# EAGLE design New_SERV_OPEN8_SOTB (EAGLE 9.6.2)
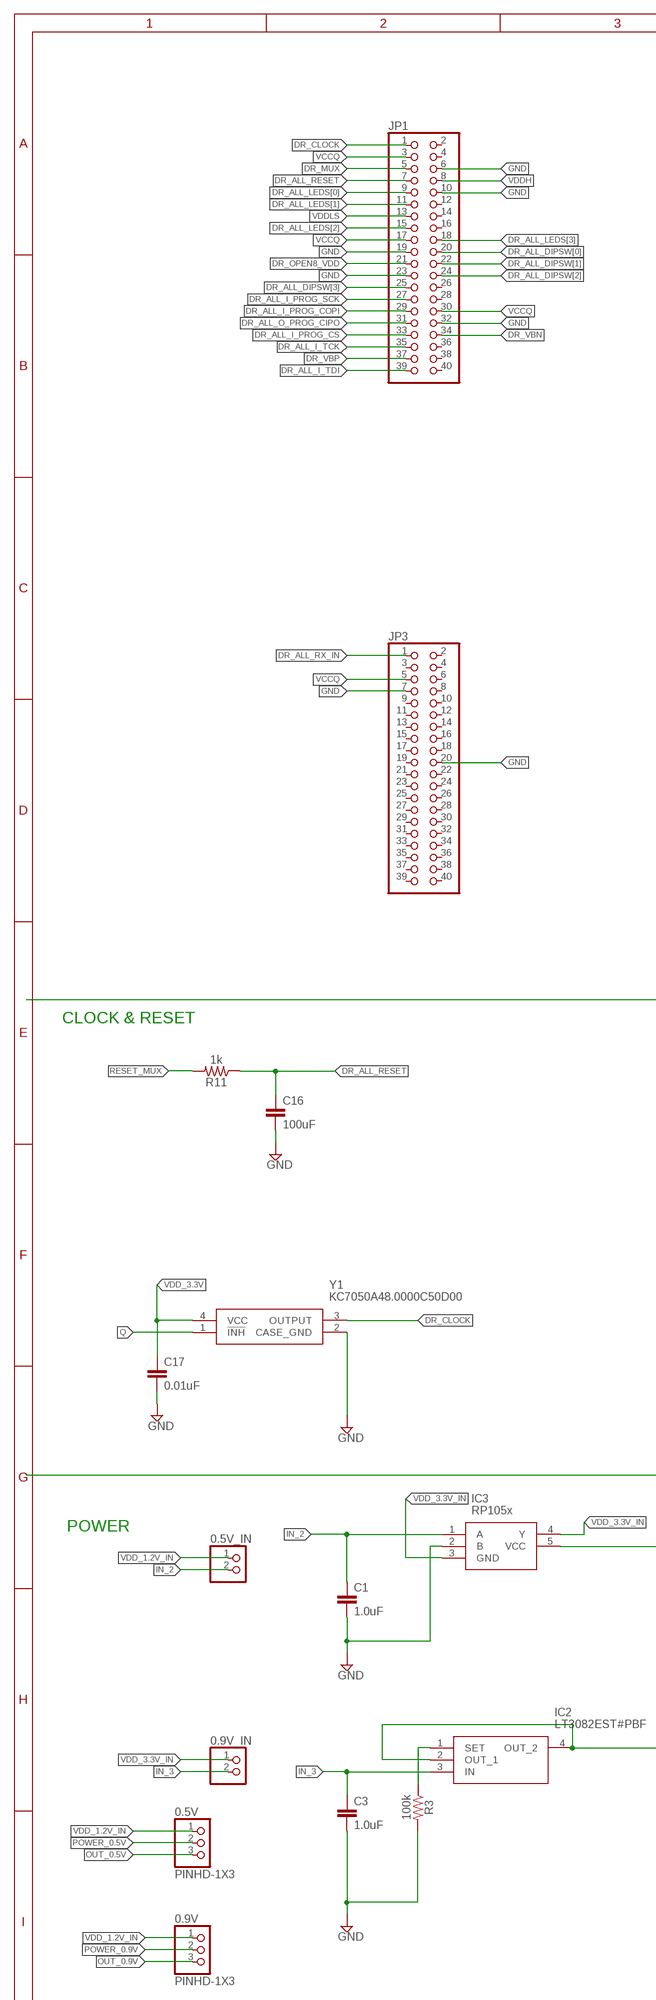
[diagram p0: schematic, sheet 1, part 1 of 2]
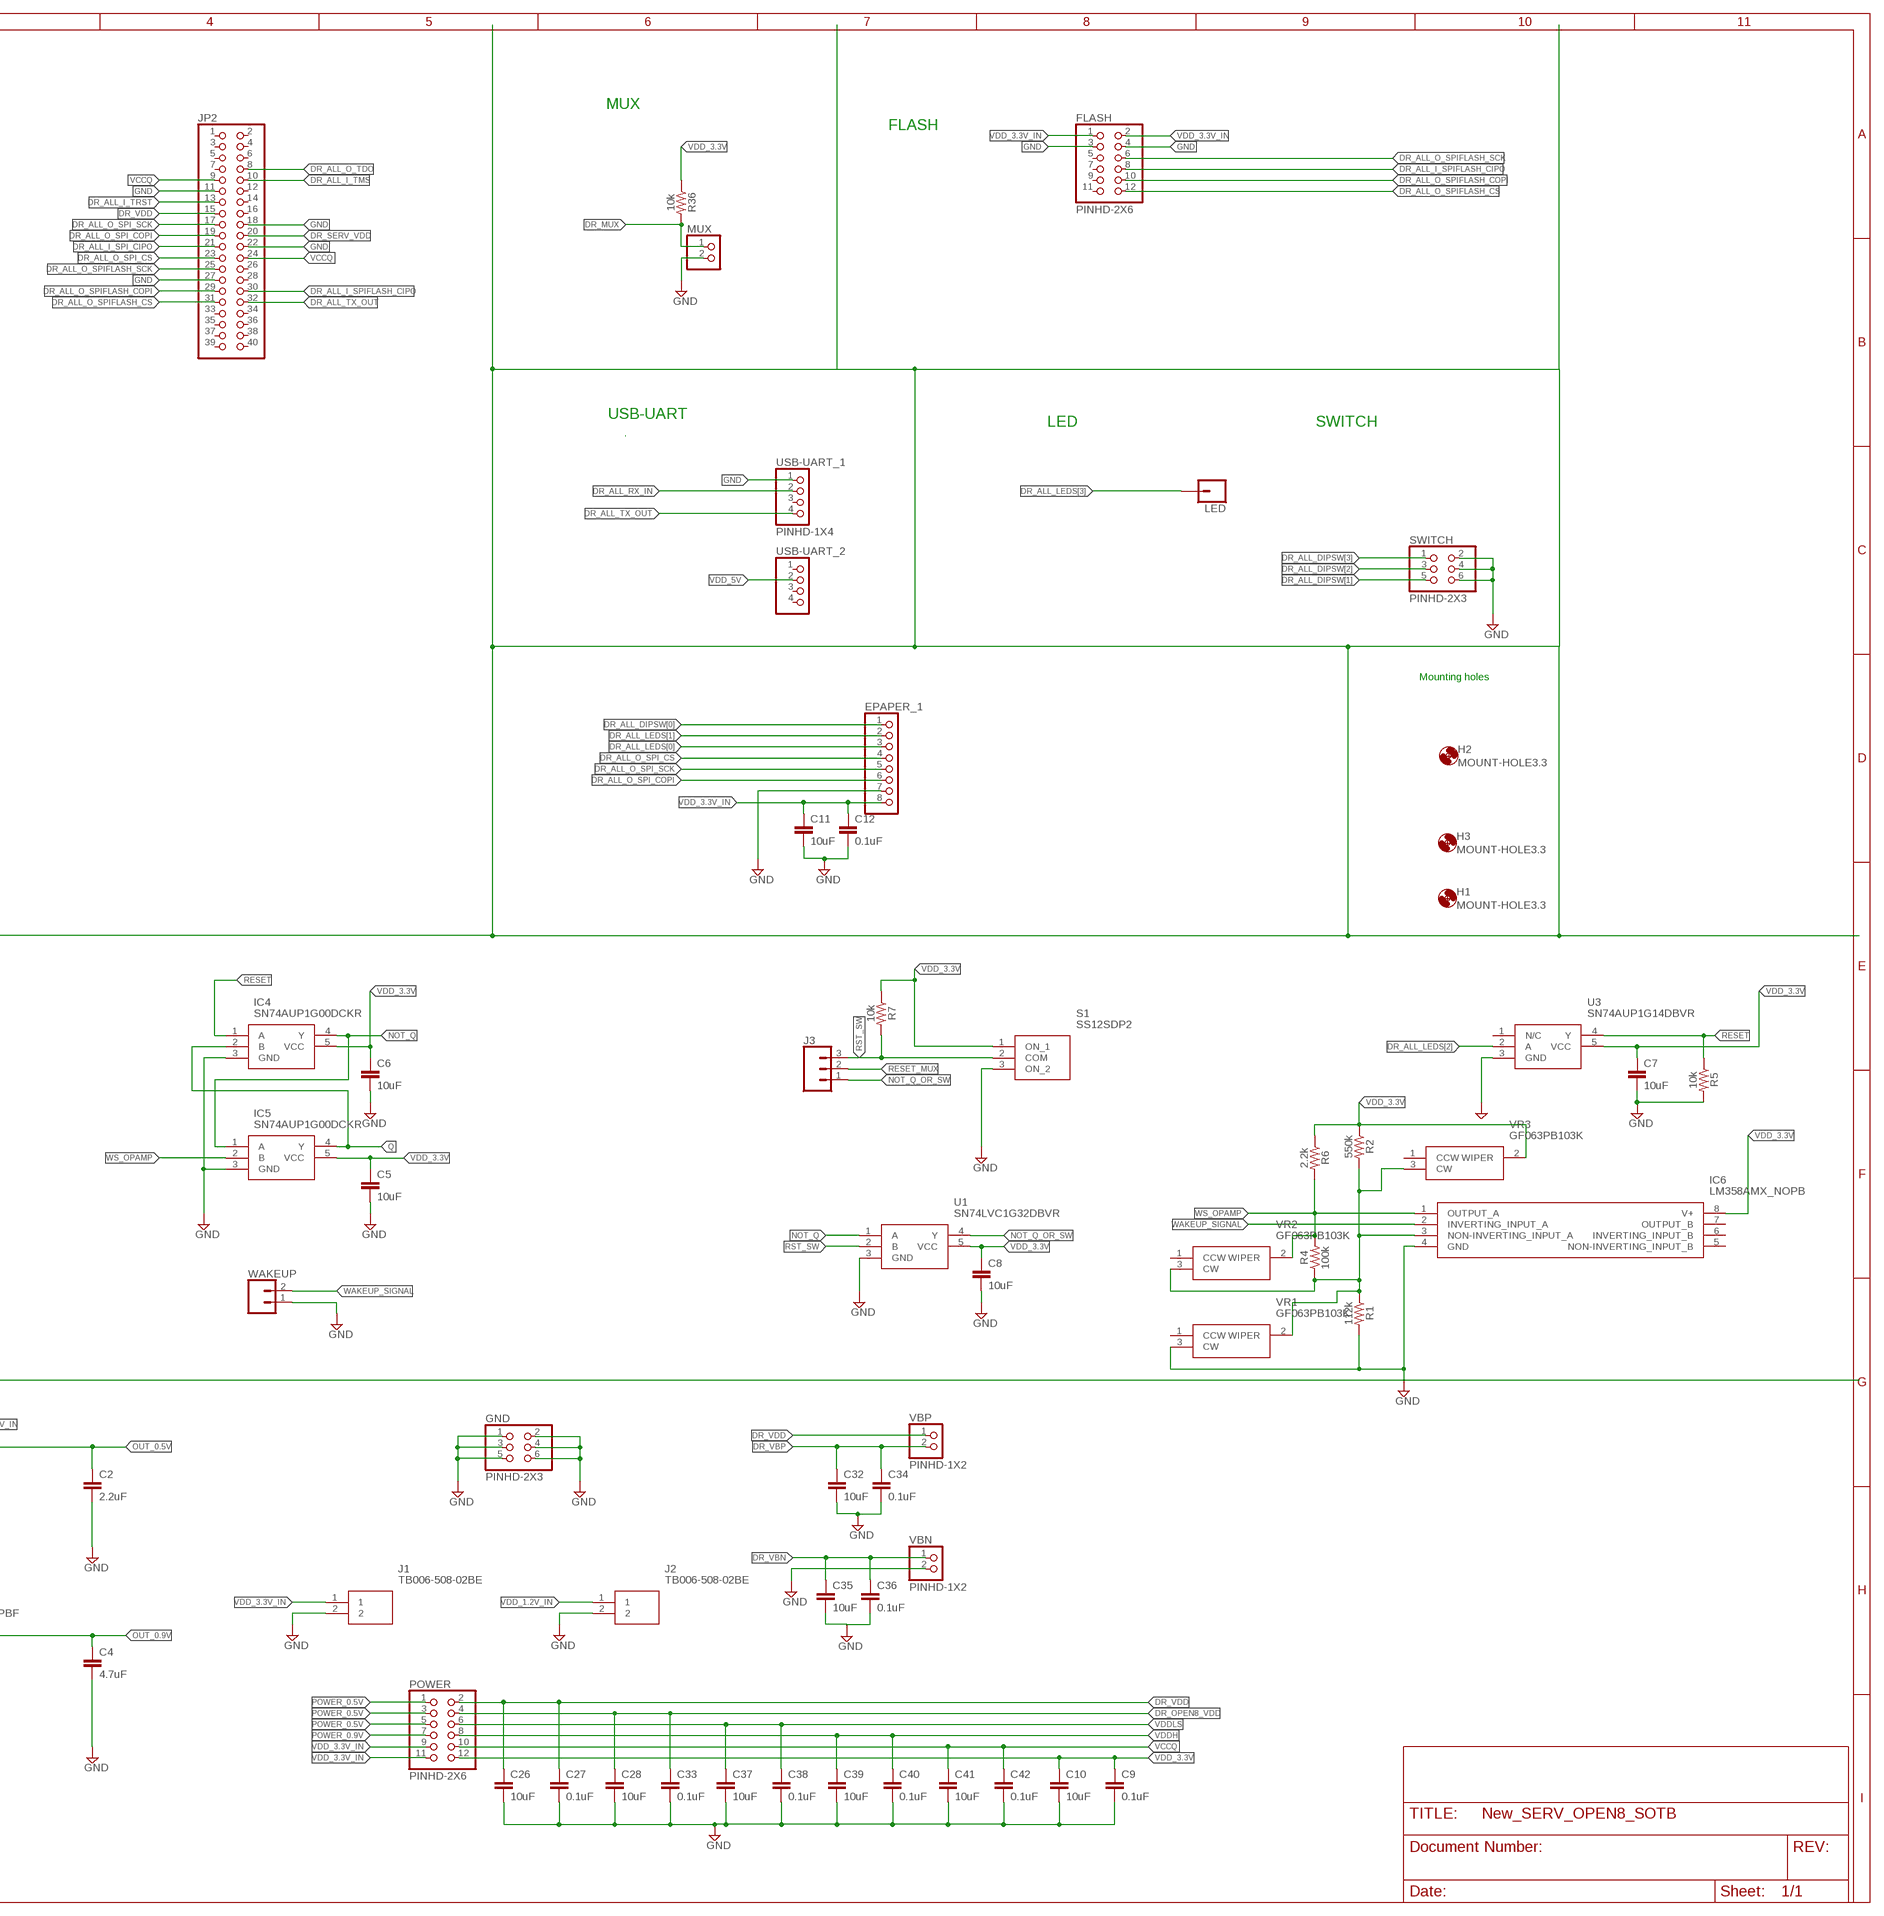
[diagram p1: schematic, sheet 1, part 2 of 2]

## Parts
0.5V  PINHD-1X3  [1X03]
0.5V_IN  PINHD-1X2  [1X02]
0.9V  PINHD-1X3  [1X03]
0.9V_IN  PINHD-1X2  [1X02]
C1  1.0uF  1.0UF-0805-25V-(+80/-20%)  [0805]
C2  2.2uF  1.0UF-0805-25V-(+80/-20%)  [0805]
C3  1.0uF  1.0UF-0805-25V-(+80/-20%)  [0805]
C4  4.7uF  1.0UF-0805-25V-(+80/-20%)  [0805]
C5  10uF  1.0UF-0805-25V-(+80/-20%)  [0805]
C6  10uF  1.0UF-0805-25V-(+80/-20%)  [0805]
C7  10uF  1.0UF-0805-25V-(+80/-20%)  [0805]
C8  10uF  1.0UF-0805-25V-(+80/-20%)  [0805]
C9  0.1uF  1.0UF-0805-25V-(+80/-20%)  [0805]
C10  10uF  1.0UF-0805-25V-(+80/-20%)  [0805]
C11  10uF  1.0UF-0805-25V-(+80/-20%)  [0805]
C12  0.1uF  1.0UF-0805-25V-(+80/-20%)  [0805]
C16  100uF  1.0UF-0805-25V-(+80/-20%)  [0805]
C17  0.01uF  1.0UF-0805-25V-(+80/-20%)  [0805]
C26  10uF  1.0UF-0805-25V-(+80/-20%)  [0805]
C27  0.1uF  1.0UF-0805-25V-(+80/-20%)  [0805]
C28  10uF  1.0UF-0805-25V-(+80/-20%)  [0805]
C32  10uF  1.0UF-0805-25V-(+80/-20%)  [0805]
C33  0.1uF  1.0UF-0805-25V-(+80/-20%)  [0805]
C34  0.1uF  1.0UF-0805-25V-(+80/-20%)  [0805]
C35  10uF  1.0UF-0805-25V-(+80/-20%)  [0805]
C36  0.1uF  1.0UF-0805-25V-(+80/-20%)  [0805]
C37  10uF  1.0UF-0805-25V-(+80/-20%)  [0805]
C38  0.1uF  1.0UF-0805-25V-(+80/-20%)  [0805]
C39  10uF  1.0UF-0805-25V-(+80/-20%)  [0805]
C40  0.1uF  1.0UF-0805-25V-(+80/-20%)  [0805]
C41  10uF  1.0UF-0805-25V-(+80/-20%)  [0805]
C42  0.1uF  1.0UF-0805-25V-(+80/-20%)  [0805]
EPAPER_1  PINHD-1X8  [1X08]
FLASH  PINHD-2X6  [2X06]
GND  PINHD-2X3  [2X03]
H1  MOUNT-HOLE3.3  [3,3]
H2  MOUNT-HOLE3.3  [3,3]
H3  MOUNT-HOLE3.3  [3,3]
IC2  LT3082EST#PBF  [SOT230P700X180-4N]
IC3  RP105x  SN74LVC1G32DBVR  [SOT95P280X145-5N]
IC4  SN74AUP1G00DCKR  [SOT65P210X110-5N]
IC5  SN74AUP1G00DCKR  [SOT65P210X110-5N]
IC6  LM358AMX_NOPB  [SOIC127P600X175-8N]
J1  TB006-508-02BE  [TB00650802BE]
J2  TB006-508-02BE  [TB00650802BE]
J3  CONN_03  [1X03]
JP1  PINHD-2X20  [2X20]
JP2  PINHD-2X20  [2X20]
JP3  PINHD-2X20  [2X20]
LED  CONN_01  [1X01]
MUX  PINHD-1X2  [1X02]
POWER  PINHD-2X6  [2X06]
R1  112k  0.3OHM-0805-1/8W-1%  [0805]
R2  550k  0.3OHM-0805-1/8W-1%  [0805]
R3  100k  0.3OHM-0805-1/8W-1%  [0805]
R4  100k  0.3OHM-0805-1/8W-1%  [0805]
R5  10k  0.3OHM-0805-1/8W-1%  [0805]
R6  2.2k  0.3OHM-0805-1/8W-1%  [0805]
R7  10k  0.3OHM-0805-1/8W-1%  [0805]
R11  1k  0.3OHM-0805-1/8W-1%  [0805]
R36  10k  0.3OHM-0805-1/8W-1%  [0805]
S1  SS12SDP2  [SS12SDP2]
SWITCH  PINHD-2X3  [2X03]
U1  SN74LVC1G32DBVR  [SOT95P280X145-5N]
U3  SN74AUP1G14DBVR  [SOT65P210X110-5N]
USB-UART_1  PINHD-1X4  [1X04]
USB-UART_2  PINHD-1X4  [1X04]
VBN  PINHD-1X2  [1X02]
VBP  PINHD-1X2  [1X02]
VR1  GF063PB103K  [GF063PB103K]
VR2  GF063PB103K  [GF063PB103K]
VR3  GF063PB103K  [GF063PB103K]
WAKEUP  CONN_02  [1X02]
Y1  KC7050A48.0000C50D00  [KC7050A480000C50D00]

## Nets
DR_ALL_DIPSW[0]: EPAPER_1.1 JP1.20
DR_ALL_DIPSW[1]: JP1.22 SWITCH.5
DR_ALL_DIPSW[2]: JP1.24 SWITCH.3
DR_ALL_DIPSW[3]: JP1.25 SWITCH.1
DR_ALL_I_PROG_COPI: JP1.29
DR_ALL_I_PROG_CS: JP1.33
DR_ALL_I_PROG_SCK: JP1.27
DR_ALL_I_SPI_CIPO: JP2.21
DR_ALL_I_SPIFLASH_CIPO: FLASH.8 JP2.30
DR_ALL_I_TCK: JP1.35
DR_ALL_I_TDI: JP1.39
DR_ALL_I_TMS: JP2.10
DR_ALL_I_TRST: JP2.13
DR_ALL_LEDS[0]: EPAPER_1.3 JP1.9
DR_ALL_LEDS[1]: EPAPER_1.2 JP1.11
DR_ALL_LEDS[2]: JP1.15 U3.2(A)
DR_ALL_LEDS[3]: JP1.18 LED.1
DR_ALL_O_PROG_CIPO: JP1.31
DR_ALL_O_SPI_COPI: EPAPER_1.6 JP2.19
DR_ALL_O_SPI_CS: EPAPER_1.4 JP2.23
DR_ALL_O_SPI_SCK: EPAPER_1.5 JP2.17
DR_ALL_O_SPIFLASH_COPI: FLASH.10 JP2.29
DR_ALL_O_SPIFLASH_CS: FLASH.12 JP2.31
DR_ALL_O_SPIFLASH_SCK: FLASH.6 JP2.25
DR_ALL_O_TDO: JP2.8
DR_ALL_RESET: C16.1 JP1.7 R11.1
DR_ALL_RX_IN: JP3.1 USB-UART_1.2
DR_ALL_TX_OUT: JP2.32 USB-UART_1.4
DR_CLOCK: JP1.1 Y1.3(OUTPUT)
DR_MUX: JP1.5 MUX.1 R36.2
DR_OPEN8_VDD: C28.1 C33.1 JP1.21 POWER.4
DR_SERV_VDD: JP2.20
DR_VBN: C35.1 C36.1 JP1.34 VBN.1
DR_VBP: C32.1 C34.1 JP1.37 VBP.2
DR_VDD: C26.1 C27.1 JP2.15 POWER.2 VBP.1
GND: C1.2 C2.2 C3.2 C4.2 C5.2 C6.2 C7.2 C8.2 C9.2 C10.2 C11.2 C12.2 C16.2 C17.2 C26.2 C27.2 C28.2 C32.2 C33.2 C34.2 C35.2 C36.2 C37.2 C38.2 C39.2 C40.2 C41.2 C42.2 EPAPER_1.7 FLASH.3 FLASH.4 GND.1 GND.2 GND.3 GND.4 GND.5 GND.6 IC3.2(B) IC4.3(GND) IC5.3(GND) IC6.4(GND) J1.2 J2.2 JP1.6 JP1.10 JP1.19 JP1.23 JP1.32 JP2.11 JP2.18 JP2.22 JP2.27 JP3.7 JP3.20 MUX.2 R1.2 R3.2 R5.2 S1.3(ON_2) SWITCH.2 SWITCH.4 SWITCH.6 U1.3(GND) U3.3(GND) USB-UART_1.1 VBN.2 VR1.3(CW) WAKEUP.1 Y1.2(CASE_GND)
IN_2: 0.5V_IN.2 C1.1 IC3.1(A)
IN_3: 0.9V_IN.2 C3.1 IC2.3(IN)
N$1: IC2.1(SET) R3.1
N$4: IC6.3(NON-INVERTING_INPUT_A) R1.1 R2.2 R4.1 VR1.2(WIPER) VR2.3(CW) VR3.3(CW)
NOT_Q: IC4.4(Y) IC5.1(A) U1.1(A)
NOT_Q_OR_SW: J3.1 U1.4(Y)
OUT_0.5V: 0.5V.3 C2.1 IC3.5(VCC)
OUT_0.9V: 0.9V.3 C4.1 IC2.2(OUT_1) IC2.4(OUT_2)
POWER_0.5V: 0.5V.2 POWER.1 POWER.3 POWER.5
POWER_0.9V: 0.9V.2 POWER.7
Q: IC4.2(B) IC5.4(Y) Y1.1(!INH)
RESET: IC4.1(A) R5.1 U3.4(Y)
RESET_MUX: J3.2 R11.2
RST_SW: J3.3 R7.2 S1.2(COM) U1.2(B)
VCCQ: C41.1 C42.1 JP1.3 JP1.17 JP1.30 JP2.9 JP2.24 JP3.5 POWER.10
VDD_1.2V_IN: 0.5V.1 0.5V_IN.1 0.9V.1 J2.1
VDD_3.3V: C5.1 C6.1 C7.1 C8.1 C9.1 C10.1 C17.1 IC4.5(VCC) IC5.5(VCC) IC6.8(V+) POWER.12 R2.1 R6.1 R7.1 R36.1 S1.1(ON_1) U1.5(VCC) U3.5(VCC) VR3.2(WIPER) Y1.4(VCC)
VDD_3.3V_IN: 0.9V_IN.1 C11.1 C12.1 EPAPER_1.8 FLASH.1 FLASH.2 IC3.3(GND) IC3.4(Y) J1.1 POWER.9 POWER.11
VDD_5V: USB-UART_2.2
VDDH: C39.1 C40.1 JP1.8 POWER.8
VDDLS: C37.1 C38.1 JP1.13 POWER.6
WAKEUP_SIGNAL: IC6.2(INVERTING_INPUT_A) WAKEUP.2
WS_OPAMP: IC5.2(B) IC6.1(OUTPUT_A) R4.2 R6.2 VR2.2(WIPER)
Unconnected: FLASH.5 FLASH.7 FLASH.9 FLASH.11 IC6.5(NON-INVERTING_INPUT_B) IC6.6(INVERTING_INPUT_B) IC6.7(OUTPUT_B) JP1.2 JP1.4 JP1.12 JP1.14 JP1.16 JP1.26 JP1.28 JP1.36 JP1.38 JP1.40 JP2.1 JP2.2 JP2.3 JP2.4 JP2.5 JP2.6 JP2.7 JP2.12 JP2.14 JP2.16 JP2.26 JP2.28 JP2.33 JP2.34 JP2.35 JP2.36 JP2.37 JP2.38 JP2.39 JP2.40 JP3.2 JP3.3 JP3.4 JP3.6 JP3.8 JP3.9 JP3.10 JP3.11 JP3.12 JP3.13 JP3.14 JP3.15 JP3.16 JP3.17 JP3.18 JP3.19 JP3.21 JP3.22 JP3.23 JP3.24 JP3.25 JP3.26 JP3.27 JP3.28 JP3.29 JP3.30 JP3.31 JP3.32 JP3.33 JP3.34 JP3.35 JP3.36 JP3.37 JP3.38 JP3.39 JP3.40 U3.1(N/C) USB-UART_1.3 USB-UART_2.1 USB-UART_2.3 USB-UART_2.4 VR1.1(CCW) VR2.1(CCW) VR3.1(CCW)

## Notes on the sheet
- MUX
- FLASH
- USB-UART
- LED | SWITCH
- Mounting holes
- CLOCK & RESET
- POWER

## Library data of the parts
0.5V 0.9V = Connector:PINHD-1X3: PIN HEADER; CATEGORY: CONNECTOR; SUB-CATEGORY: PIN-HEADER
0.5V_IN 0.9V_IN MUX = pinhead:PINHD-1X2: PIN HEADER
C1 C3 = SparkFun-Capacitors:1.0UF: 1µF ceramic capacitors A capacitor is a passive two-terminal electrical component used to store electrical energy temporarily in an electric field.; PROD_ID: CAP-11625
C2 C4-C12 C16 C17 C26-C28 C32-C42 = SparkFun-Capacitors:1.0UF: 1µF ceramic capacitors A capacitor is a passive two-terminal electrical component used to store electrical energy temporarily in an electric field.; PROD_ID: CAP-11625; VALUE: 1.0uF
EPAPER_1 = pinhead:PINHD-1X8: PIN HEADER
FLASH POWER = Connector:PINHD-2X6: PIN HEADER; CATEGORY: CONNECTOR; SUB-CATEGORY: PIN-HEADER
GND SWITCH = Connector:PINHD-2X3: PIN HEADER; CATEGORY: CONNECTOR; SUB-CATEGORY: PIN-HEADER
H1-H3 = holes:MOUNT-HOLE: MOUNTING HOLE with drill center marker
IC2 = SamacSys_Parts:LT3082EST#PBF: LINEAR TECHNOLOGY - LT3082EST#PBF - LDO, ADJ, 1.3VDO, 0.2A, 3SOT223 Source: Datasheet <http://www.analog.com/media/en/technical-documentation/data-sheets/3082f.pdf>; ARROW_PART_NUMBER: LT3082EST#PBF; ARROW_PRICE-STOCK: https://www.arrow.com/en/products/lt3082estpbf/analog-devices?region=nac; DESCRIPTION: LINEAR TECHNOLOGY - LT3082EST#PBF - LDO, ADJ, 1.3VDO, 0.2A, 3SOT223; HEIGHT: 1.8mm; MANUFACTURER_NAME: Analog Devices; MANUFACTURER_PART_NUMBER: LT3082EST#PBF; MOUSER_PART_NUMBER: 584-LT3082EST#PBF; MOUSER_PRICE-STOCK: https://www.mouser.co.uk/ProductDetail/Analog-Devices/LT3082ESTPBF?qs=hVkxg5c3xu%2FanvAoIh3BmA%3D%3D
IC3 U1 = SamacSys_Parts:SN74LVC1G32DBVR: Texas Instruments SN74LVC1G32DBVR, 2-Input OR Logic Gate, 1.65 5.5 V, 5-Pin SOT-23 Source: Datasheet <http://www.ti.com/lit/gpn/sn74lvc1g32>; ARROW_PART_NUMBER: SN74LVC1G32DBVR; ARROW_PRICE-STOCK: https://www.arrow.com/en/products/sn74lvc1g32dbvr/texas-instruments?region=nac; DESCRIPTION: Texas Instruments SN74LVC1G32DBVR, 2-Input OR Logic Gate, 1.65 5.5 V, 5-Pin SOT-23; HEIGHT: 1.45mm; MANUFACTURER_NAME: Texas Instruments; MANUFACTURER_PART_NUMBER: SN74LVC1G32DBVR; MOUSER_PART_NUMBER: 595-SN74LVC1G32DBVR; MOUSER_PRICE-STOCK: https://www.mouser.co.uk/ProductDetail/Texas-Instruments/SN74LVC1G32DBVR?qs=3pnr37ZAbK%2F6ArGi%2FPb2Ng%3D%3D
IC4 IC5 = SamacSys_Parts:SN74AUP1G00DCKR: Low-Power Single Two-Input Positive-NAND Gate Source: Datasheet <http://www.ti.com/lit/gpn/sn74aup1g00>; ARROW_PART_NUMBER: SN74AUP1G00DCKR; ARROW_PRICE-STOCK: https://www.arrow.com/en/products/sn74aup1g00dckr/texas-instruments; DESCRIPTION: Low-Power Single Two-Input Positive-NAND Gate; HEIGHT: 1.1mm; MANUFACTURER_NAME: Texas Instruments; MANUFACTURER_PART_NUMBER: SN74AUP1G00DCKR; MOUSER_PART_NUMBER: 595-SN74AUP1G00DCKR; MOUSER_PRICE-STOCK: https://www.mouser.co.uk/ProductDetail/Texas-Instruments/SN74AUP1G00DCKR?qs=iO7mgM19OaY6H4H9CbnK7w%3D%3D
IC6 = SamacSys_Parts:LM358AMX_NOPB: Operational Amplifiers - Op Amps LOW PWR DUAL OP AMP Source: Datasheet <http://www.ti.com/lit/ds/symlink/lm358-n.pdf>; ARROW_PART_NUMBER: LM358AMX/NOPB; ARROW_PRICE-STOCK: https://www.arrow.com/en/products/lm358amxnopb/texas-instruments?region=nac; DESCRIPTION: Operational Amplifiers - Op Amps LOW PWR DUAL OP AMP; HEIGHT: 1.75mm; MANUFACTURER_NAME: Texas Instruments; MANUFACTURER_PART_NUMBER: LM358AMX/NOPB; MOUSER_PART_NUMBER: 926-LM358AMX/NOPB; MOUSER_PRICE-STOCK: https://www.mouser.co.uk/ProductDetail/Texas-Instruments/LM358AMX-NOPB?qs=QbsRYf82W3GCS6w419KcQg%3D%3D
J1 J2 = SamacSys_Parts:TB006-508-02BE: Fixed Terminal Blocks screw type, 5.08 , horizontal, 2 poles, CUI Blue, slotted screw, PCB mount Source: Datasheet <https://datasheet.datasheetarchive.com/originals/distributors/Datasheets_SAMA/b266c411a02422edb513b788238f8420.pdf>; ARROW_PART_NUMBER: TB006-508-02BE; ARROW_PRICE-STOCK: https://www.arrow.com/en/products/tb006-508-02be/cui-devices?region=nac; DESCRIPTION: Fixed Terminal Blocks screw type, 5.08 , horizontal, 2 poles, CUI Blue, slotted screw, PCB mount; HEIGHT: 10.4mm; MANUFACTURER_NAME: CUI Inc.; MANUFACTURER_PART_NUMBER: TB006-508-02BE; MOUSER_PART_NUMBER: 490-TB006-508-02BE; MOUSER_PRICE-STOCK: https://www.mouser.co.uk/ProductDetail/CUI-Devices/TB006-508-02BE?qs=vLWxofP3U2wEdOVV%2FaT04w%3D%3D
J3 = SparkFun-Connectors:CONN_03: Multi connection point. Often used as Generic Header-pin footprint for 0.1 inch spaced/style header connections On any of the 0.1 inch spaced packages, you can populate with these: Break Away Headers - Straight <https://www.sparkfun.com/products/116> (PRT-00116) Break Away Male Headers - Right Angle <https://www.sparkfun.com/products/553> (PRT-00553) Female Headers <https://www.sparkfun.com/products/115> (PRT-00115) Break Away Headers - Machine Pin <https://www.sparkfun.com/products/117> (PRT-00117) Break Away Female Headers - Swiss Machine Pin <https://www.sparkfun.com/products/743> (PRT-00743) Stackable Header - 3 Pin (Female, 0.1") <https://www.sparkfun.com/products/13875> (PRT-13875) For SCREWTERMINALS and SPRING TERMINALS visit here: Screw Terimnals on SparkFun.com <https://www.sparkfun.com/search/results?term=Screw+Terminals> (5mm/3.5mm/2.54mm spacing) This device is also useful as a general connection point to wire up your design to another part of your project. Our various solder wires solder well into these plated through hole pads. Hook-Up Wire - Assortment (Stranded, 22 AWG) <https://www.sparkfun.com/products/11375> (PRT-11375) Hook-Up Wire - Assortment (Solid Core, 22 AWG) <https://www.sparkfun.com/products/11367> (PRT-11367) View the entire wire category on our website here <https://www.sparkfun.com/categories/141> Special notes: Molex polarized connector foot print use with SKU : PRT-08232 with associated crimp pins and housings.
JP1-JP3 = pinhead:PINHD-2X20: PIN HEADER
LED = SparkFun-Connectors:CONN_01: Single connection point. Often used as Generic Header-pin footprint for 0.1 inch spaced/style header connections On any of the 0.1 inch spaced packages, you can populate with these: Break Away Headers - Straight <https://www.sparkfun.com/products/116> (PRT-00116) Break Away Male Headers - Right Angle <https://www.sparkfun.com/products/553> (PRT-00553) Female Headers <https://www.sparkfun.com/products/115> (PRT-00115) Break Away Headers - Machine Pin <https://www.sparkfun.com/products/117> (PRT-00117) Break Away Female Headers - Swiss Machine Pin <https://www.sparkfun.com/products/743> (PRT-00743) This device is also useful as a general connection point to wire up your design to another part of your project. Our various solder wires solder well into these plated through hole pads. Hook-Up Wire - Assortment (Stranded, 22 AWG) <https://www.sparkfun.com/products/11375> (PRT-11375) Hook-Up Wire - Assortment (Solid Core, 22 AWG) <https://www.sparkfun.com/products/11367> (PRT-11367) View the entire wire category on our website here <https://www.sparkfun.com/categories/141> Special notes: SMTSO-256-ET is a "flush mount" nut for a 4-40 screw. We mostly use this on specialty testbeds; it is a nice way to connect hardware to your PCB at an adjustable hieght. Also note, the SNAP packages are for using a snappable style connector. We sell a baggie of snaps and they are also used on two LilyPad designs: Snap Assortment - 30 pack (male and female) <https://www.sparkfun.com/products/11347> (DEV-11347) LilyPad Arduino SimpleSnap <https://www.sparkfun.com/products/10941> (DEV-10941) LilyPad SimpleSnap Protoboard <https://www.sparkfun.com/products/10940> (DEV-10940)
R1-R7 R11 R36 = SparkFun-Resistors:0.3OHM: 0.3Ω resistor A resistor is a passive two-terminal electrical component that implements electrical resistance as a circuit element. Resistors act to reduce current flow, and, at the same time, act to lower voltage levels within circuits. - Wikipedia; PROD_ID: RES-11622; VALUE: 0.3
S1 = SamacSys_Parts:SS12SDP2: Switch, Slide,Sub Miniature,Top Actuated,SPDT, On-none-On Source: Datasheet; DESCRIPTION: Switch, Slide,Sub Miniature,Top Actuated,SPDT, On-none-On; HEIGHT: 4mm; MANUFACTURER_NAME: NKK Switches; MANUFACTURER_PART_NUMBER: SS12SDP2; MOUSER_PART_NUMBER: 633-SS12SDP2; MOUSER_PRICE-STOCK: https://www.mouser.co.uk/ProductDetail/NKK-Switches/SS12SDP2?qs=Av7JdS0MGqKsG%252BWOKKtU2w%3D%3D
U3 = SamacSys_Parts:SN74AUP1G14DBVR: Low-Power Single Schmitt-Trigger Inverter Source: Datasheet <http://www.ti.com/lit/ds/symlink/sn74aup1g14.pdf>; ARROW_PART_NUMBER: SN74AUP1G14DBVR; ARROW_PRICE-STOCK: https://www.arrow.com/en/products/sn74aup1g14dbvr/texas-instruments?region=nac; DESCRIPTION: Low-Power Single Schmitt-Trigger Inverter; HEIGHT: 1.1mm; MANUFACTURER_NAME: Texas Instruments; MANUFACTURER_PART_NUMBER: SN74AUP1G14DBVR; MOUSER_PART_NUMBER: 595-SN74AUP1G14DBVR; MOUSER_PRICE-STOCK: https://www.mouser.co.uk/ProductDetail/Texas-Instruments/SN74AUP1G14DBVR?qs=X3IDIfI%252BJAUKbJXbV%252BNpVw%3D%3D
USB-UART_1 USB-UART_2 = Connector:PINHD-1X4: PIN HEADER; CATEGORY: CONNECTOR; SUB-CATEGORY: PIN-HEADER
VBN VBP = Connector:PINHD-1X2: PIN HEADER; CATEGORY: CONNECTOR; SUB-CATEGORY: PIN-HEADER
VR1-VR3 = SamacSys_Parts:GF063PB103K: Trimmer, Cermet, 0.5W, 10000ohm, 10% +/-Tol, 1 Turn(s) Source: Datasheet <https://akizukidenshi.com/download/ds/tocos/gf063_series-1.pdf>; DESCRIPTION: Trimmer, Cermet, 0.5W, 10000ohm, 10% +/-Tol, 1 Turn(s); HEIGHT: 5.8mm; MANUFACTURER_NAME: Tocos; MANUFACTURER_PART_NUMBER: GF063PB103K
WAKEUP = SparkFun-Connectors:CONN_02: Multi connection point. Often used as Generic Header-pin footprint for 0.1 inch spaced/style header connections On any of the 0.1 inch spaced packages, you can populate with these: Break Away Headers - Straight <https://www.sparkfun.com/products/116> (PRT-00116) Break Away Male Headers - Right Angle <https://www.sparkfun.com/products/553> (PRT-00553) Female Headers <https://www.sparkfun.com/products/115> (PRT-00115) Break Away Headers - Machine Pin <https://www.sparkfun.com/products/117> (PRT-00117) Break Away Female Headers - Swiss Machine Pin <https://www.sparkfun.com/products/743> (PRT-00743) For SCREWTERMINALS and SPRING TERMINALS visit here: Screw Terimnals on SparkFun.com <https://www.sparkfun.com/search/results?term=Screw+Terminals> (5mm/3.5mm/2.54mm spacing) This device is also useful as a general connection point to wire up your design to another part of your project. Our various solder wires solder well into these plated through hole pads. Hook-Up Wire - Assortment (Stranded, 22 AWG) <https://www.sparkfun.com/products/11375> (PRT-11375) Hook-Up Wire - Assortment (Solid Core, 22 AWG) <https://www.sparkfun.com/products/11367> (PRT-11367) View the entire wire category on our website here <https://www.sparkfun.com/categories/141> Special notes: Molex polarized connector foot print use with: PRT-08233 with associated crimp pins and housings. 2.54_SCREWTERM for use with PRT-10571. 3.5mm Screw Terminal footprints for PRT-08084 5mm Screw Terminal footprints for use with PRT-08432
Y1 = SamacSys_Parts:KC7050A48.0000C50D00: KC7050A48.0000C50D00, Crystal Oscillator, 48 MHz, +/-50ppm CMOS 50pF, 4-Pin CSMD, 7 x 5 x 1.6mm Source: Datasheet <https://docs.rs-online.com/1608/0900766b814e16c1.pdf>; DESCRIPTION: KC7050A48.0000C50D00, Crystal Oscillator, 48 MHz, +/-50ppm CMOS 50pF, 4-Pin CSMD, 7 x 5 x 1.6mm; HEIGHT: 1.8mm; MANUFACTURER_NAME: KYOCERA; MANUFACTURER_PART_NUMBER: KC7050A48.0000C50D00; MOUSER_PART_NUMBER: 581-KC7050A48C50D; MOUSER_PRICE-STOCK: https://www.mouser.co.uk/ProductDetail/Kyocera-Electronic-Components/KC7050A480000C50D00/?qs=K%252BkT2xeNSS2rXkPeAZTJXQ%3D%3D

## Board
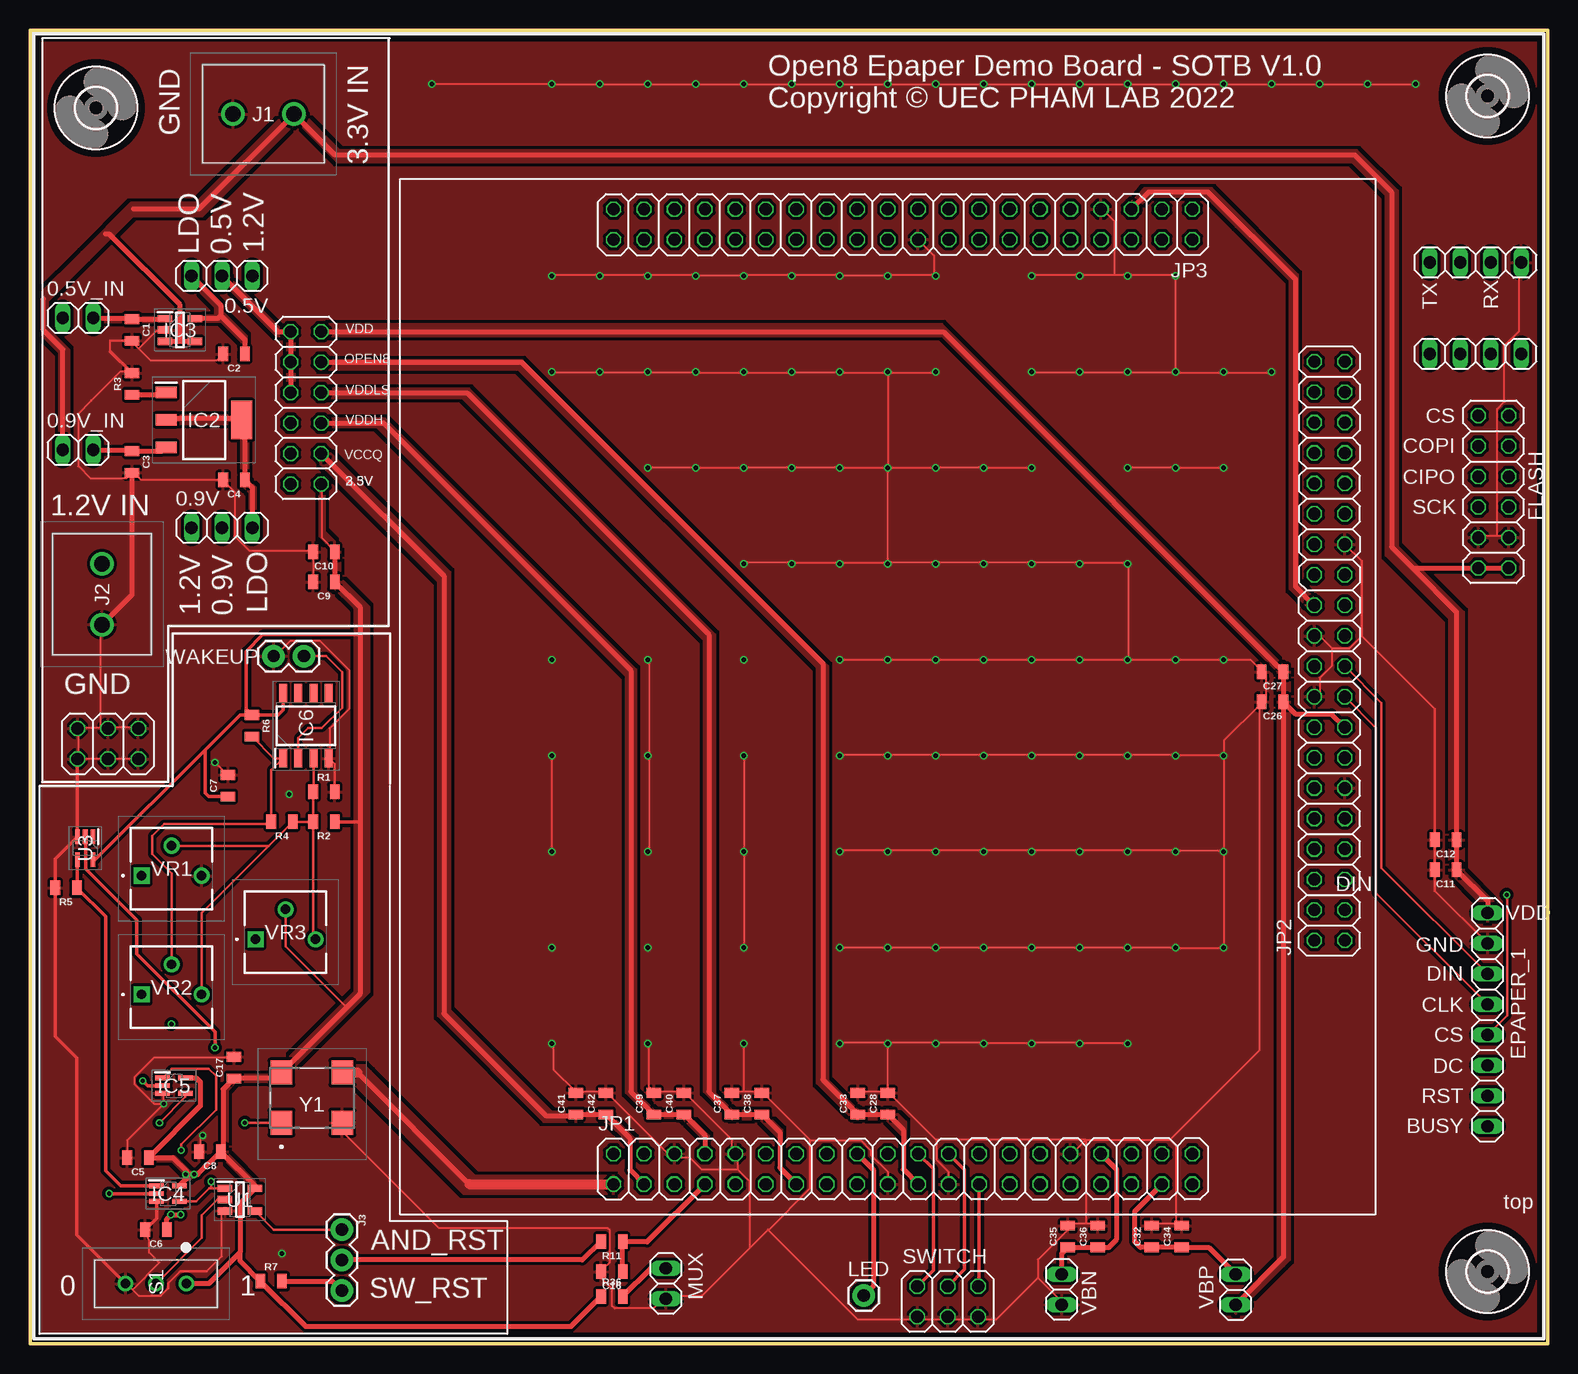
[diagram p2: board, top side]
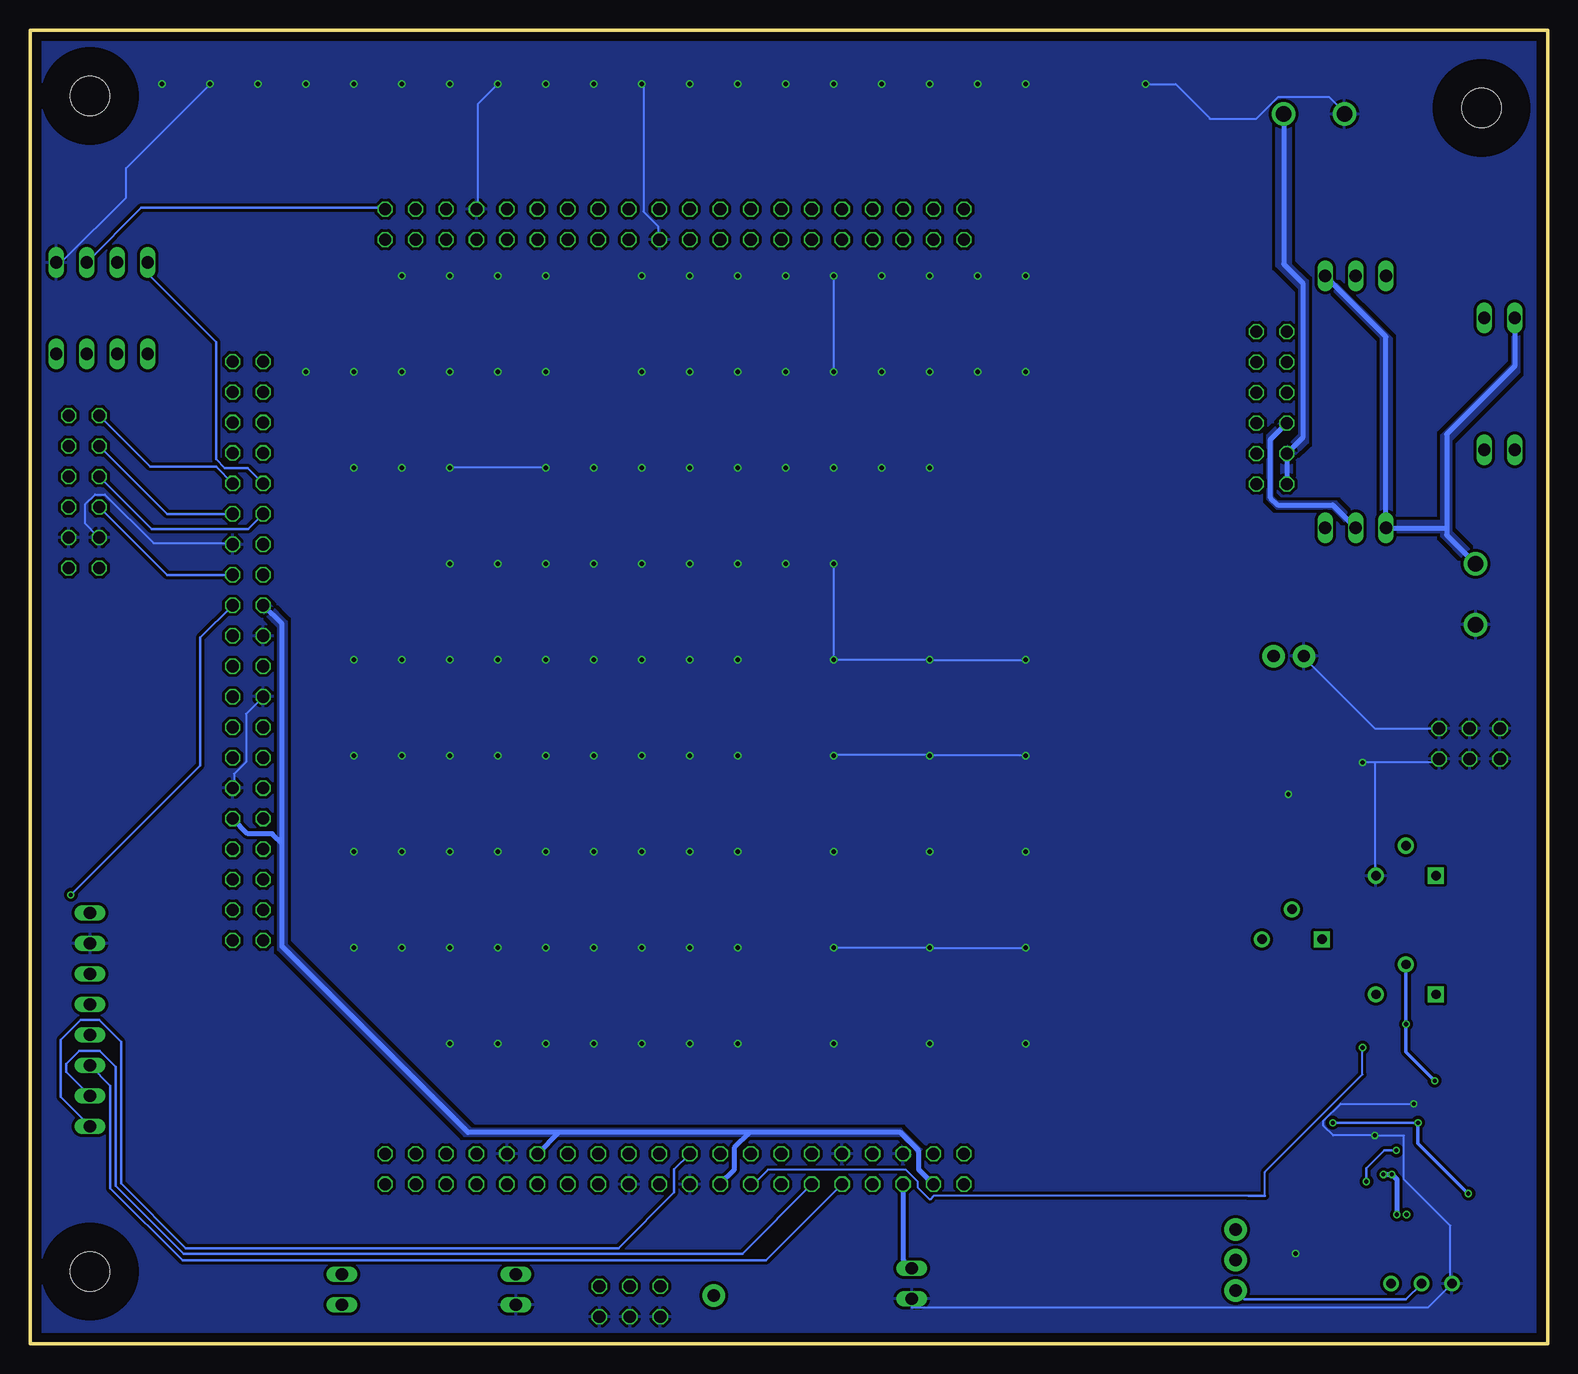
[diagram p3: board, bottom side, seen from below]

Size 126.5 x 109.5 mm. Coordinates in mm from the lower left corner, seen from the top.
Outline: 126.5,109.5 126.5,0 0,0 0,109.5 126.5,109.5
Copper layers (1*16): Top 0.035mm / dielectric 1.5mm / Bottom 0.035mm
Design rules "default *": minimum track width 6mil, minimum drill 0.35mm, track to track 10mil, track to pad 10mil, pad to pad 6mil, via to via 10mil, smd to smd 10mil, copper to edge 30mil, drill to drill 6mil, minimum pad ring 0.13mm, minimum via ring 0.13mm, stop-mask expansion 4mil, vias tented up to drill 0mil, thermal gap 10mil

### Footprints (pad centres in the part's own frame; a part is rotated, then mirrored left to right if it is on the bottom)
1X03 = drill 1.016 long: 1 -2.54,0; 2 0,0; 3 2.54,0
1X02 = drill 1.016 long: 1 -1.27,0; 2 1.27,0
0805 = smd 0.8 x 1.2: 1 -0.9,0; 2 0.9,0
1X08 = drill 1.016 long: 1 -8.89,0; 2 -6.35,0; 3 -3.81,0; 4 -1.27,0; 5 1.27,0; 6 3.81,0; 7 6.35,0; 8 8.89,0
2X06 = drill 1.016 octagon: 1 -6.35,-1.27; 2 -6.35,1.27; 3 -3.81,-1.27; 4 -3.81,1.27; 5 -1.27,-1.27; 6 -1.27,1.27; 7 1.27,-1.27; 8 1.27,1.27; 9 3.81,-1.27; 10 3.81,1.27; 11 6.35,-1.27; 12 6.35,1.27
2X03 = drill 1.016 octagon: 1 -2.54,-1.27; 2 -2.54,1.27; 3 0,-1.27; 4 0,1.27; 5 2.54,-1.27; 6 2.54,1.27
3,3 = hole 3.3: 0,0
SOT230P700X180-4N = smd 1.75 x 0.95: 1 -3.15,2.3; 2 -3.15,0; 3 -3.15,-2.3 | smd 1.75 x 3.2: 4 3.15,0
SOT95P280X145-5N = smd 1.2 x 0.6: 1 -1.25,0.95; 2 -1.25,0; 3 -1.25,-0.95; 4 1.25,-0.95; 5 1.25,0.95
SOT65P210X110-5N = smd 1.2 x 0.4: 1 -0.95,0.65; 2 -0.95,0; 3 -0.95,-0.65; 4 0.95,-0.65; 5 0.95,0.65
SOIC127P600X175-8N = smd 1.528 x 0.65: 1 -2.711,1.905; 2 -2.711,0.635; 3 -2.711,-0.635; 4 -2.711,-1.905; 5 2.711,-1.905; 6 2.711,-0.635; 7 2.711,0.635; 8 2.711,1.905
TB00650802BE = drill 1.3 pad 1.95: 1 0,0; 2 5.08,0
1X03' = drill 1.016 pad 1.88: 1 0,0; 2 2.54,0; 3 5.08,0
2X20 = drill 1.016 octagon: 1 -24.13,-1.27; 2 -24.13,1.27; 3 -21.59,-1.27; 4 -21.59,1.27; 5 -19.05,-1.27; 6 -19.05,1.27; 7 -16.51,-1.27; 8 -16.51,1.27; 9 -13.97,-1.27; 10 -13.97,1.27; 11 -11.43,-1.27; 12 -11.43,1.27; 13 -8.89,-1.27; 14 -8.89,1.27; 15 -6.35,-1.27; 16 -6.35,1.27; 17 -3.81,-1.27; 18 -3.81,1.27; 19 -1.27,-1.27; 20 -1.27,1.27; 21 1.27,-1.27; 22 1.27,1.27; 23 3.81,-1.27; 24 3.81,1.27; 25 6.35,-1.27; 26 6.35,1.27; 27 8.89,-1.27; 28 8.89,1.27; 29 11.43,-1.27; 30 11.43,1.27; 31 13.97,-1.27; 32 13.97,1.27; 33 16.51,-1.27; 34 16.51,1.27; 35 19.05,-1.27; 36 19.05,1.27; 37 21.59,-1.27; 38 21.59,1.27; 39 24.13,-1.27; 40 24.13,1.27
1X01 = drill 1.016 pad 1.88: 1 0,0
SS12SDP2 = drill 0.8 pad 1.3: 1 0,2.54; 2 0,0; 3 0,-2.54
1X04 = drill 1.016 long: 1 -3.81,0; 2 -1.27,0; 3 1.27,0; 4 3.81,0
GF063PB103K = drill 0.78 pad 1.337 square: 1 0,0 | drill 0.78 pad 1.337: 2 2.5,2.5; 3 5,0
1X02' = drill 1.016 pad 1.88: 1 0,0; 2 2.54,0
KC7050A480000C50D00 = smd 1.8 x 2: 1 -2.54,-2.1; 2 2.54,-2.1; 3 2.54,2.1; 4 -2.54,2.1

### Placement (x,y rotation side)
0.5V  16,89 180 top
0.5V_IN  4,85.5 0 top
0.9V  16,68 0 top
0.9V_IN  4,74.5 0 top
C1  8.5,84.5 270 top
C2  17,82.5 180 top
C3  8.5,73.5 270 top
C4  17,72 180 top
C5  9,15.5 180 top
C6  10.5,9.5 180 top
C7  16.5,46.5 90 top
C8  15,16 180 top
C9  24.5,63.5 180 top
C10  24.5,66 180 top
C11  118,39.5 180 top
C12  118,42 180 top
C16  48.5,6 180 top
C17  17,23 90 top
C26  103.58,53.5 180 top
C27  103.58,56 180 top
C28  71.5,20 90 top
C32  93.5,8.92 90 top
C33  69,20 90 top
C34  96,8.92 90 top
C35  86.5,8.92 90 top
C36  89,8.92 90 top
C37  58.5,20 90 top
C38  61,20 90 top
C39  52,20 90 top
C40  54.5,20 90 top
C41  45.5,20 90 top
C42  48,20 90 top
EPAPER_1  121.5,27 90 top
FLASH  122,71 90 top
GND  6.5,50 0 top
H1  121.5,6 0 top
H2  121.5,104 0 top
H3  5.5,103 0 top
IC2  14.5,77 0 top
IC3  12.5,84.5 0 top
IC4  11.5,12.5 0 top
IC5  12,21.5 0 top
IC6  23,51.5 90 top
J1  22,102.5 180 top
J2  6,65 270 top
J3  [1X03']  26,9.5 270 top
JP1  72.77,14.55 0 top
JP2  108.33,57.73 90 top
JP3  72.77,93.29 180 top
LED  69.5,4 0 top
MUX  53,5 270 top
POWER  23,78 270 top
R1  24.5,46 0 top
R2  24.5,43.5 180 top
R3  8.5,80 90 top
R4  21,43.5 180 top
R5  3,38 180 top
R6  18.5,51.5 270 top
R7  20.1,5.2 0 top
R11  48.5,8.5 180 top
R36  48.5,3.92 0 top
S1  10.5,5 270 top
SWITCH  76.5,3.5 180 top
U1  17.5,12 0 top
U3  4.6,41.3 270 top
USB-UART_1  120.5,90.12 180 top
USB-UART_2  120.5,82.5 180 top
VBN  86,4.5 270 top
VBP  100.5,4.5 90 top
VR1  9.3,39 0 top
VR2  9.3,29.1 0 top
VR3  18.8,33.7 0 top
WAKEUP  [1X02']  20.3,57.3 0 top
Y1  23.5,20.5 0 top

### Tracks (layer width: path | path; a pad name or v marks a point on that pad's centre or on a via)
DR_ALL_DIPSW[0]
  Bottom 0.2: JP1.20 72.8,14.52 72.8,12.6 77.45,7.95 113.51,7.95 118.89,13.33 118.89,25.16 120.73,27 122.27,27 123.95,25.32 123.95,20.56 EPAPER_1.1
DR_ALL_DIPSW[1]
  Top 0.305: SWITCH.5 75.3,6.11 75.3,14.56 JP1.22
DR_ALL_DIPSW[2]
  Top 0.305: JP1.24 77.9,14.5 77.9,6.17 SWITCH.3
DR_ALL_DIPSW[3]
  Top 0.305: JP1.25 79.12,4.85 SWITCH.1
DR_ALL_I_SPIFLASH_CIPO
  Bottom 0.2: JP2.30 108.32,67.9 116.36,67.9 FLASH.8
DR_ALL_LEDS[0]
  Bottom 0.2: JP1.9 65.13,6.95 113.79,6.95 119.8,12.96 119.8,21.49 EPAPER_1.3
DR_ALL_LEDS[1]
  Bottom 0.2: JP1.11 67.12,7.5 113.7,7.5 119.35,13.15 119.35,23.08 120.67,24.4 122.4,24.4 123.5,23.3 123.5,22.65 EPAPER_1.2
DR_ALL_LEDS[2]  (via drill 0.35)
  Top 0.305: U3.2 4.64,42.21 4.64,39.58 8.9,35.33 8.9,32.5 15.42,25.98 v15.42,24.66
  Bottom 0.152: JP1.15 66,13.5 65,14.5 53.5,14.5 52.5,13.5 52.5,13 51.5,12 51.19,12.31 24.94,12.31 | v15.42,24.66 15.42,22.42 23.55,14.3 23.55,12.31
  Bottom 0.2: 23.55,12.31 24.94,12.31
DR_ALL_LEDS[3]
  Top 0.406: JP1.18 70.3,14.48 70.3,4.8 LED.1
DR_ALL_O_SPI_COPI
  Top 0.2: JP2.19 112.65,53.41 112.65,39.66 EPAPER_1.6
DR_ALL_O_SPI_CS  (via drill 0.35)
  Top 0.2: EPAPER_1.4 123.13,27.36 123.13,37.37 v123.1,37.4
  Bottom 0.2: v123.1,37.4 112.3,48.2 112.3,58.84 JP2.23
DR_ALL_O_SPI_SCK
  Top 0.2: EPAPER_1.5 112.2,37.57 112.2,51.32 JP2.17
DR_ALL_O_SPIFLASH_COPI
  Bottom 0.2: JP2.29 115.08,69.16 FLASH.10
DR_ALL_O_SPIFLASH_CS
  Bottom 0.2: JP2.31 111,73.1 116.48,73.1 FLASH.12
DR_ALL_O_SPIFLASH_SCK
  Bottom 0.2: FLASH.6 115.08,64.08 JP2.25
DR_ALL_RESET
  Top 0.406: JP1.7 51.44,8.46 49.44,8.46 | 49.44,8.46 R11.1 | C16.1 49.4,8.42 49.44,8.46
DR_ALL_RX_IN
  Bottom 0.2: USB-UART_1.2 117.22,94.67 97.01,94.67 JP3.1
DR_ALL_TX_OUT
  Bottom 0.2: USB-UART_1.4 116.69,89.19 111,83.5 111,73.74 110.26,73 108.36,73 JP2.32
DR_CLOCK
  Top 0.406: 27.3,22.6 36.62,13.28
  Top 0.813: Y1.3 27.3,22.6 | 36.62,13.28 JP1.1
  pour Top: 26.5,22.1 36.1,12.5 48.2,12.5 48.9,12.5 49.2,12.8 49.2,13.5 48.7,14 37.1,14 28.4,22.7 27.9,23.2 26.2,23.2 26.2,22.4
DR_MUX
  Top 0.406: R36.2 51.75,6.27 MUX.1
  Bottom 0.406: JP1.5 53.72,6.99 MUX.1
DR_OPEN8_VDD
  Top 0.406: POWER.4 40.99,81.81 66.1,56.7 66.1,22 C33.1 C28.1 72.8,17.8 72.8,14.52 JP1.21
  pour Top: 24,82 41,82 66.5,56.5 66.5,22 69,19.5 72,19.5 73,18.5 73,17 71.3,18.7 68.6,18.7 65.6,21.7 65.6,56.3 40.7,81.2 24.2,81.2 23.9,81.5 23.9,81.9
DR_VBN
  Top 0.406: VBN.1 86,7.52 C35.1 C36.1 89.92,8.02 90.6,8.7 90.6,14.5 JP1.34
DR_VBP
  Top 0.406: VBP.2 98.25,8.02 C34.1 C32.1 92.58,8.02 92.1,8.5 92.1,11.02 JP1.37
DR_VDD
  Top 0.406: POWER.2 76.13,84.35 C27.1 C26.1 | C26.1 105.48,52.5 108.48,52.5 JP2.15 | C26.1 104.48,7.21 VBP.1
  pour Top: 104,56.5 104,7 102,5 100,3 100.5,2.5 104.5,6.5 105,7 105,10 105,56.5
  pour Top: 24,84 76,84 104,56 104,54 104.5,53.5 105,54 105,56 76,85 24.5,85 24,84.5
GND  (via drill 0.35, 0.4)
  Top 0.152: 122.3,67.33 123.11,67.33 FLASH.3 | 122.3,67.33 120.88,67.33 FLASH.4 | 122.3,67.33 122.3,77.9 122.91,78.51 122.91,83.18 124.13,84.4 124.13,90.09 USB-UART_1.1 | 15.98,7.27 15.98,10.78 U1.3 | 10.1,3.98 9.07,3.98 8.56,4.5 | 8.56,4.5 8.06,5 S1.3 | 8.56,4.5 10.79,6.73 9.93,7.59 9.93,8.4 9.97,8.44 C6.2 | 48,21 45.5,21 C41.2 45.49,21 43.66,22.83 43.66,24.86 v43.5,25 | 48,21 53.5,15.5 JP1.6 54,15.5 55,15.5 56,14.5 59,14.5 | 48,21 C42.2 | 54.5,21 52,21 C39.2 51.99,21 51.59,21.41 51.59,24.86 v51.5,25 | 54.5,21 58.5,17 58.5,16 JP1.10 59,15.5 59,14.5 | 54.5,21 C40.2 | 61,21 59.51,21 | 59.51,21 58.5,21 C37.2 | 61,21 65,17 65,16.94 | 60,8 56,4 53,4 MUX.2 52.81,3.73 51.99,2.92 48.74,2.92 48.54,3.12 48.54,4.54 47.73,5.35 47.73,5.97 C16.2 47.73,6.17 48.34,6.78 48.34,9.42 48.13,9.62 34.09,9.62 26.04,17.68 Y1.2 | 60,8 61.5,9.5 | 61,21 C38.2 | 59,14.5 60,13.5 60,8 | 71.5,21 69,21 C33.2 | 71.5,21 75.5,17 75.56,17 | 71.5,21 C28.2 v71.5,25 71.5,25.07 | C26.2 103,53.5 103,56 C27.2 102.59,56.16 101.78,56.97 99.54,56.97 v99.5,57 99.34,56.97 95.68,56.97 v95.5,57 95.48,56.97 91.62,56.97 v91.5,57 | 88,10 89,10 C36.2 | 88,10 86.5,10 C35.2 86.5,9.5 84,7 84,5.5 | 95.5,10 96,10 C34.2 95.5,10 | 95.5,10 93.5,10 C32.2 | 95.5,10 95.5,16.5 95,17 | 88,17 95,17 | 88,17 87,16 JP1.32 | 88,17 88,10 | 95,17 102.5,24.5 102.5,53.5 C26.2 | 84,5.5 86,3.5 VBN.2 | 88,17 75.56,17 | 61.5,9.5 69,2 74,2 76.6,2 79.2,2 80.5,2 84,5.5 | 9.07,82.93 8.5,83.5 C1.2 | 9.07,82.93 10,82 15.6,82 C2.2 | 8.5,72.5 C3.2 | 4,77.5 4,73.13 4.07,73.13 5.08,72.11 8.01,72.11 C3.2 | 108.5,58 108.5,56.5 107.5,55.5 107.5,54 JP2.18 | 108.5,58 107.5,59 JP2.22 | 111,59 110,58 108.5,58
  Top 0.152: v33.5,105 v43.5,105 v47.5,105 v51.5,105 v55.5,105 v59.5,105 v63.5,105 v67.5,105 v71.5,105 v75.5,105 v79.5,105 v83.5,105 v87.5,105 v91.5,105 v95.5,105 v99.5,105 v103.5,105 v107.5,105 v111.5,105 v115.5,105 | C9.2 23.62,63.52 23.62,65.85 C10.2 23.55,66.11 18.26,66.11 17.04,67.33 17.04,70.99 16.23,71.8 C4.2 9.26,72 8.65,72.61 C3.2 | v14.4,17.34 14.2,17.14 14.2,16.12 C8.2 | v11.15,19.99 8.1,16.94 8.1,15.52 C5.2 | C17.2 16.84,23.85 10.34,23.85 8.71,22.22 8.71,21.61 10.34,19.99 v11.15,19.99 | v11.15,19.99 11.15,20.8 IC5.3 | GND.4 6.68,51.37 8.91,51.37 GND.6 | 4.04,48.73 4.04,51.17 GND.2 4.04,51.37 5.87,51.37 | GND.5 8.91,48.73 6.68,48.73 GND.3 6.48,48.73 4.3,48.73 4.04,48.73 | 4.04,48.73 GND.1 | 5.87,51.37 6.48,51.37 GND.4 | 5.87,51.37 5.87,59.81 J2.2 | 5.87,51.37 GND.4 | v91.5,73 91.62,73.02 95.48,73.02 v95.5,73 95.68,73.02 99.34,73.02 v99.5,73 | v83.5,73 83.49,73.02 79.63,73.02 v79.5,73 79.42,73.02 75.56,73.02 v75.5,73 75.36,73.02 71.5,73.02 | v51.5,73 51.59,73.02 55.45,73.02 v55.5,73 55.65,73.02 59.31,73.02 v59.5,73 59.51,73.02 63.37,73.02 v63.5,73 63.58,73.02 67.44,73.02 v67.5,73 67.64,73.02 71.5,73.02 | v43.5,41 43.46,41.12 43.46,48.84 v43.5,49 | v59.5,49 59.51,48.84 59.51,41.12 v59.5,41 59.51,40.91 59.51,33.19 v59.5,33 | v51.5,41 51.59,41.12 51.59,48.84 v51.5,49 51.59,49.04 51.59,56.97 v51.5,57 | v59.5,65 59.51,65.1 63.37,65.1 v63.5,65 63.58,65.1 67.44,65.1 v67.5,65 67.64,65.1 71.5,65.1 | 71.5,65.1 75.36,65.1 v75.5,65 75.56,65.1 79.42,65.1 v79.5,65 79.63,65.1 83.49,65.1 v83.5,65 83.69,65.1 87.35,65.1 v87.5,65 87.55,65.1 91.41,65.1 v91.5,65 91.62,64.89 91.62,57.17 v91.5,57
  Top 0.152: 71.5,65.1 v71.5,73 71.5,73.02 | 71.5,65.1 v71.5,65 | v71.5,32.99 67.64,32.99 v67.5,33 | v71.5,32.99 75.36,32.99 v75.5,33 75.56,32.99 79.42,32.99 v79.5,33 79.63,32.99 v83.49,32.99 v83.5,33 83.69,32.99 87.35,32.99 v87.5,33 87.55,32.99 91.41,32.99 v91.5,33 91.62,32.99 95.48,32.99 v95.5,33 95.68,32.99 99.34,32.99 v99.5,33 99.54,33.19 99.54,40.91 v99.5,41 | v71.5,32.99 v71.5,33 | 71.5,41.12 67.64,41.12 v67.5,41 | 71.5,41.12 75.36,41.12 v75.5,41 75.56,41.12 79.42,41.12 v79.5,41 79.63,41.12 83.49,41.12 v83.5,41 83.69,41.12 87.35,41.12 v87.5,41 87.55,41.12 91.41,41.12 v91.5,41 91.62,41.12 95.48,41.12 v95.5,41 95.68,41.12 99.34,41.12 v99.5,41 | 71.5,41.12 v71.5,41 | 71.5,80.95 67.64,80.95 v67.5,81 67.44,80.95 63.58,80.95 v63.5,81 63.37,80.95 59.51,80.95 v59.5,81 59.31,80.95 55.65,80.95 v55.5,81 55.45,80.95 51.59,80.95 v51.5,81 51.38,80.95 47.52,80.95 v47.5,81 47.32,80.95 43.66,80.95 v43.5,81 | 71.5,80.95 75.36,80.95 v75.5,81 | 71.5,49.04 67.64,49.04 v67.5,49 | 71.5,49.04 75.36,49.04 v75.5,49 75.56,49.04 79.42,49.04 v79.5,49 79.63,49.04 83.49,49.04 v83.5,49 83.69,49.04 87.35,49.04 v87.5,49 87.55,49.04 91.41,49.04 v91.5,49 91.62,49.04 95.48,49.04 v95.5,49 95.68,49.04 99.34,49.04 v99.5,49 | 71.5,49.04 v71.5,49 | 71.5,56.97 67.64,56.97 v67.5,57 | 71.5,56.97 75.36,56.97 v75.5,57 75.56,56.97 79.42,56.97 v79.5,57 79.63,56.97 83.49,56.97 v83.5,57 83.69,56.97 87.35,56.97 v87.5,57 87.55,56.97 91.41,56.97 v91.5,57 | 71.5,56.97 v71.5,57 | v91.5,25 91.41,25.07 87.55,25.07 v87.5,25 87.35,25.07 83.69,25.07 v83.5,25 83.49,25.07 79.63,25.07 v79.5,25 79.42,25.07 75.56,25.07 v75.5,25 75.36,25.07 71.5,25.07
  Top 0.152: 71.5,25.07 67.64,25.07 v67.5,25 | v83.5,81 83.69,80.95 87.35,80.95 v87.5,81 87.55,80.95 91.41,80.95 v91.5,81 91.62,80.95 95.48,80.95 v95.5,81 | v95.5,81 95.68,80.95 99.34,80.95 v99.5,81 99.54,80.95 103.4,80.95 v103.5,81 | v43.5,89 43.66,89.07 47.32,89.07 v47.5,89 47.52,89.07 51.38,89.07 v51.5,89 51.59,89.07 55.45,89.07 v55.5,89 55.65,89.07 59.31,89.07 v59.5,89 59.51,89.07 63.37,89.07 v63.5,89 63.58,89.07 67.44,89.07 v67.5,89 67.64,89.07 71.5,89.07 | v83.5,89 83.69,89.07 87.35,89.07 v87.5,89 87.55,89.07 90.4,89.07 | 90.4,89.07 91.41,89.07 v91.5,89 91.62,89.07 95.48,89.07 v95.5,89 95.48,88.87 95.48,81.15 v95.5,81 | 59.51,21 59.51,24.86 v59.5,25 | 75.36,89.07 75.36,90.7 JP3.20 | 75.36,89.07 71.5,89.07 | 71.5,89.07 v71.5,89 | 75.36,89.07 v75.5,89 | 90.4,89.07 90.4,93.54 89.38,94.56 JP3.7 | v99.5,49 99.54,49.04 99.54,50.26 102.59,53.31 C26.2 | v99.5,41 99.54,41.12 99.54,48.84 v99.5,49 | 9.07,82.93 10.54,84.4 11.15,84.4 IC3.2 | JP1.19 71.5,14.3 70.08,15.72 70.08,16.12 69.27,16.94 65,16.94 | JP1.23 76.58,14.3 75.56,15.31 75.56,17 | 71.5,80.95 71.5,73.02 | 71.5,80.95 v71.5,81 | 65,16.94 65,12.9 61.6,9.5 61.5,9.5 | 6.7,82.7 6.7,83.6 | 5.1,78.6 7.55,81.05 8.35,81.05 | v15.42,48.43 16.43,47.42 C7.2 | IC6.4 24.97,48.84 24.97,51.28 26.59,52.9 26.59,56.16 24.15,58.59 21.72,58.59 20.5,57.37 WAKEUP.1
  Top 0.2: 15.98,7.27 14.72,6 12.5,6 11.5,5 11.5,4.58 10.9,3.98 10.1,3.98 | EPAPER_1.7 117.1,37.75 C11.2 C12.2 117.1,52.9 111,59 111,65.22 JP2.27 | C1.2 6.7,83.6 | 4,77.5 5.1,78.6 | R3.2 8.35,81.05 | IC6.4 25.4,48.29 R1.2
  Top 0.305: S1.3 3.9,9.06 3.9,23.8 2.1,25.6 R5.2 2.1,40.4 U3.3 3.95,48.38 4.3,48.73 | IC4.3 10.55,10.45 C6.2 | SWITCH.6 73.96,2.04 74,2 | SWITCH.4 76.5,2.1 76.6,2 | SWITCH.2 79.04,2.16 79.2,2 | R3.2 6.7,82.7
  Top 0.406: J2.2 8.5,62.42 8.5,72.5
  Bottom 0.152: USB-UART_1.1 124.13,90.29 123.72,90.29 118.5,95.52 118.5,98 v111.5,105 | JP2.11 109.5,46.5 109.5,47.5 108.5,48.5 108.5,52.5 107.5,53.5 JP2.18 | v33.5,105 31,105 28.12,102.12 28.16,102.08 24.3,102.08 22.47,103.91 18.2,103.91 16.98,102.69 J1.2 | MUX.2 53,3 10,3 8,5 S1.3 8.1,5.15 8.1,9.83 11.96,13.69 11.96,17.34 v14.4,17.34 17.85,17.34 18.67,18.16 18.67,18.56 17.25,19.99 v11.15,19.99 | JP3.20 74.14,92.12 74.14,93.14 75.36,94.36 75.36,104.92 v75.5,105 | JP3.7 89.18,94.56 89.18,103.3 87.55,104.92 v87.5,105 | JP2.27 109.7,66.72 116.2,66.72 120.27,70.79 121.08,70.79 121.89,69.97 121.89,68.35 120.88,67.33 FLASH.4 | v91.5,73 91.41,73.02 83.69,73.02 v83.5,73 | v43.5,33 43.66,32.99 51.38,32.99 v51.5,33 51.59,32.99 59.31,32.99 v59.5,33 | v59.5,49 59.31,49.04 51.59,49.04 v51.5,49 51.38,49.04 43.66,49.04 v43.5,49 | v43.5,57 43.66,56.97 51.38,56.97 v51.5,57 51.59,56.97 59.31,56.97 v59.5,57 59.51,57.17 59.51,64.89 v59.5,65 | v59.5,81 59.51,81.15 59.51,88.87 v59.5,89 | 14.4,48.43 9.32,48.43 9.12,48.64 GND.5 | 14.4,48.43 v15.42,48.43 | 14.4,48.43 14.4,39.09 VR1.3 | GND.6 9.12,51.28 14.4,51.28 20.29,57.17 WAKEUP.1
  other vias: 21,7.5 21.6,45.8
  pour Top (rank 2): 0.3,46 0.3,0.1 86.7,0.1 126.3,0.1 126.3,39.6 126.3,109.2 0.6,109.2 0.3,109.2 0.3,108.2
  pour Bottom (rank 2): 0.2,44.6 0.2,0.2 126.4,0.2 126.4,109.2 0.2,109.2
IN_2
  Top 0.406: IC3.1 11.2,85.5 11.1,85.4 C1.1 8.4,85.5 0.5V_IN.2
  pour Top: 5,85.6 11.3,85.6 10.8,85.1 5.5,85.1
IN_3
  Top 0.406: 0.9V_IN.2 8.4,74.5 C3.1 11.05,74.4 IC2.3
N$1
  Top 0.406: R3.1 11.15,79.1 IC2.1
N$4
  Top 0.2: IC6.3 23.63,46.1 | 23.63,46.1 23.63,46.03 R1.1 | R2.2 R4.1 19.9,41.5 | R2.2 23.6,46.06 23.63,46.1 | 19.9,41.5 VR1.2 | R2.2 23.6,33.9 VR3.3 | VR2.3 14.3,35.9 19.9,41.5
NOT_Q  (via drill 0.35)
  Top 0.2: IC4.4 13.85,11.85 14.95,12.95 15.1,12.95 | 15.1,12.95 U1.1 | IC5.1 11.8,22.9 14.9,22.9 15.5,22.3 15.5,19.5 12.6,16.6 v12.6,16.1 | v15.1,13.5 15.1,12.95
  Bottom 0.2: v12.6,16.1 13.6,16.1 15.1,14.6 v15.1,13.5
NOT_Q_OR_SW
  Top 0.2: J3.1 20.3,9.5 U1.4
OUT_0.5V
  Top 0.406: 0.5V.3 15.9,86.56 15.9,85.7 | 15.9,85.7 17.9,83.7 C2.1 | 15.9,85.7 15.65,85.45 IC3.5
  pour Top: 13,88.8 15.4,86.4 15.4,86.3 15.4,85.7 13.9,85.7 13.8,85.6 13.8,85.2 15.9,85.2 17.6,83.5 17.6,82.4 18.2,82.4 18.1,82.5 18.1,84 16.1,86 16.1,86.5 13.5,89.1 13.4,89.2 13.3,89.2 13,88.9
OUT_0.9V
  Top 0.152: 11.35,77.09 IC2.2 | 17.45,77.09 IC2.4
  Top 0.406: IC2.4 17.9,76.75 C4.1 18.54,71.36 0.9V.3 | 17.45,77.09 11.35,77.09
  pour Top: 10.8,77.4 17.8,77.4 18.2,77 18.2,72 18.8,71.4 18.8,67.6 18.5,67.3 18.3,67.5 18.3,70.9 17.8,71.4 17.8,71.5 17.6,71.7 17.6,76.1 17.1,76.6 11.8,76.6 11.6,76.6
POWER_0.5V
  Top 0.406: 0.5V.2 20.65,84.35 POWER.1 POWER.3 POWER.5
  pour Top: 15.6,88.9 20.5,84 21.4,84 21.4,79.1 21.7,78.8 21.9,78.8 22.1,79 22.1,84.5 22,84.6 21.2,84.6 20.9,84.6 20,85.5 16.2,89.3 16,89.3
POWER_0.9V
  Bottom 0.406: POWER.7 23.1,75.36 23.1,70.5 22.5,69.9 17.9,69.9 0.9V.2
  pour Bottom: 15.6,68.2 17.6,70.2 22.5,70.2 22.9,70.6 22.9,75.4 21.7,76.6 21.7,76.9 21.8,77 22.1,77 23.4,75.7 23.4,70.4 22.6,69.6 18,69.6 16.1,67.7 15.8,67.7 15.6,67.9
Q  (via drill 0.35)
  Top 0.2: IC5.4 12.95,20.55 v10.8,18.4 | v17.9,18.4 Y1.1
  Top 0.305: IC4.2 v6.6,12.5
  Bottom 0.2: v17.9,18.4 v10.8,18.4
  Bottom 0.305: v6.6,12.5 10.8,16.7 v10.8,18.4
RESET
  Top 0.152: 3.95,38.07 4.04,38.07 R5.1
  Top 0.305: IC4.1 7.55,13.15 6.3,14.4 6.3,35.6 R5.1 | U3.4 3.95,38.07
RESET_MUX
  Top 0.406: R11.2 46.06,6.96 J3.2
RST_SW
  Top 0.2: S1.2 14.3,8.8 14.3,10.7 15.6,12 U1.2
  Top 0.406: R7.2 25.22,5.2 J3.3
  Bottom 0.2: S1.2 11.8,3.7 25.28,3.7 J3.3
VCCQ
  Top 0.406: POWER.10 34.5,63.96 34.5,27.5 43,19 45.4,19 C41.1 C42.1 50,17.1 50,14.46 JP1.3 | JP2.24 105.5,63.1 105.5,88.7 98.2,96 93.26,96 JP3.5
  Bottom 0.406: JP2.9 108.34,42.5 106.3,42.5 105.5,41.7 | 105.5,41.7 105.5,33.1 90,17.6 82.42,17.6 | 105.5,41.7 105.5,59.98 JP2.24 | JP1.3 52.4,14.5 52.4,16.05 53.95,17.6 66.5,17.6 | JP1.17 68.96,13.34 67.8,14.5 67.8,16.3 66.5,17.6 | 66.5,17.6 82.42,17.6 | 82.42,17.6 JP1.30
  pour Top: 49.8,16.8 48.1,18.5 42.8,18.5 34,27.3 34,63.5 23.8,73.7 23.8,74.4 24.1,74.7 24.6,74.7 35,64.3 35,27.8 43.5,19.3 48.2,19.3 50.4,17.1 50.4,16.8
  pour Bottom: 52.2,16.2 53.9,17.9 59.3,17.9 89.7,17.9 105.1,33.3 105.1,60.2 106.5,61.6 106.9,61.6 107.1,61.4 107.1,61 106.3,60.2 105.8,59.7 105.8,59.2 105.8,32.8 90.3,17.3 53.9,17.3 53.3,16.7 52.6,16 52.4,16
  pour Top: 106.7,61.2 105,62.9 105,66.1 105,88.6 100.5,93.1 98,95.6 95.4,95.6 93.3,95.6 92.4,94.7 92,94.3 91.6,94.3 91.6,95 92.6,96 92.9,96.3 96,96.3 98.5,96.3 105.7,89.1 105.7,63.5 106.7,62.5 107.4,61.8 107.4,61.6 107.4,61.1 107,61.1 106.8,61.1
VDD_1.2V_IN
  Bottom 0.406: 0.5V_IN.1 2.73,81.47 8.4,75.8 8.4,68 | J2.1 8.4,67.4 8.4,68 | 8.4,68 0.9V.1 13.46,83.92 0.5V.1
  pour Bottom: 18.3,89.1 13,83.8 13,68.7 13.1,68.6 8.5,68.6 8.5,67.7 8.4,67.6 13.8,67.6 13.9,67.7 13.9,83.8 19,88.9 19,89.1
  pour Bottom: 5.7,65.4 8,67.7 8,69.2 8,75.3 2.5,80.8 2.3,81 2.3,85.8 3,85.8 3,81.6 7.6,77 8.9,75.7 8.9,72.4 8.9,67.3 6.8,65.2 6.2,64.6 5.5,64.6 5.5,65.2
VDD_3.3V  (via drill 0.35)
  Top 0.152: POWER.12 24.36,71.6 24.36,67.13 25.37,66.11 C10.1
  Top 0.2: VR3.2 21.3,33.1 26.38,28.02
  Top 0.305: R2.1 27.5,43.5 | 27.5,59.1 19.4,59.1 18,57.7 18,52.9 R6.1 | R6.1 17.5,52.4 14.6,49.5 | 14.6,49.5 14.6,45.9 14.9,45.6 C7.1 | IC6.8 21.09,52.8 20.7,52.4 R6.1 | U3.5 5.45,40.35 14.6,49.5
  Top 0.406: C10.1 C9.1 27.5,61.4 27.5,59.1 27.5,43.5 27.5,29.14 26.38,28.02 Y1.4 20.46,22.1 C17.1 16.1,21.2 16.1,16.2 C8.1 | 13.1,14.09 13.1,14.3 11.9,15.5 C5.1 14.2,19.8 14.2,21.8 13.85,22.15 IC5.5 | 13.1,14.09 13.1,13.8 IC4.5 | R36.1 45.08,1.4 23,1.4 R7.1 17.5,6.9 17.5,7.59 | C8.1 13.99,14.09 13.1,14.09 | C8.1 18.75,13.15 U1.5 17.5,11.7 17.5,7.59 | C6.1 11.4,10.39 v11.76,10.74 v12.56,10.74 | v12.98,14.09 13.1,14.09 | S1.1 14.91,5 17.5,7.59
  Bottom 0.406: v13.68,14.09 v12.98,14.09 12.56,13.67 v12.56,10.74
  pour Top: 24.1,71.6 24.1,67.3 25.2,66.2 25.2,63.1 27,61.3 27,29.3 21.3,23.6 21.3,22.7 21.7,22.7 28.3,29.3 28.3,61.4 25.9,63.8 25.9,66.4 24.6,67.7 24.6,71.6
  pour Top: 20.2,22.4 17.1,22.4 16,21.3 16,16.3 14,14.3 13.4,14.3 12.1,15.6 9.9,15.6 9.8,15.5 10.1,15.2 11.8,15.2 12.9,14.1 12.9,13.8 12.3,13.2 12.9,13.2 13.6,13.9 16,15.7 16.2,15.7 16.5,16 16.5,21.1 17.2,21.8 20.3,21.8 20.2,21.9
  pour Top: 15.85,15.65 18.5,13 19.1,13 19.2,12.9 19.2,13.1 16.5,15.8 16,15.8
VDD_3.3V_IN
  Top 0.406: FLASH.1 FLASH.2 115.25,64.65 | 115.25,64.65 113.5,66.4 113.5,96 110.4,99.1 25.4,99.1 J1.1 14.1,94.6 8.62,94.6 | 115.25,64.65 118.9,61 C12.1 C11.1 121.5,36.9 EPAPER_1.8 | 0.9V_IN.1 2.73,82.87 1.12,84.48 1.12,87.1 | IC3.3 12.5,83.55 | 12.5,83.55 IC3.4 | 12.5,83.55 12.5,86.6 6.6,92.5 6.3,92.5
  Bottom 0.406: POWER.11 21.5,71.65 21.73,71.88 POWER.9 20.4,75.52 20.4,88.4 22,90 J1.1
  pour Bottom: 21.4,102 21.4,90 20,88.6 20,75.1 21.3,73.8 21.3,71.6 21.4,71.5 22,71.5 22.2,71.7 22.2,74.3 20.7,75.8 20.7,87.9 22.6,89.8 22.6,102.8 22.4,103 21.8,103 21.3,102.5 21.3,102.1
  pour Top: 21.9,102.2 25.6,98.5 110.2,98.5 113,95.7 113,65.7 118.3,60.4 118.3,39.3 120.9,36.7 120.9,35.6 121.3,35.2 121.9,35.2 122.2,35.5 122.2,36.7 119.5,39.4 119.5,61 114,66.5 114,96.1 110.6,99.5 25.8,99.5 22.5,102.8 22.4,102.8 21.9,102.3
  pour Top: 20.5,101.8 13.8,95.1 11,95.1 8.4,95.1 4.3,91 0.7,87.4 0.7,84.3 2.1,82.9 2.4,82.6 2.4,74.7 2.4,74.3 2.6,74.1 3.1,74.1 3.3,74.3 3.3,82.8 1.5,84.6 1.5,86.9 4.9,90.3 8.6,94 13.6,94 14.4,94 22.1,101.7 22.2,101.8 22.2,102.6 21.3,102.6
VDDH
  Top 0.406: POWER.8 29.47,76.73 50.1,56.1 50.1,21 C39.1 C40.1 56.26,17.34 JP1.8
  pour Top: 24.1,77.1 29.6,77.1 50.5,56.2 50.5,21 52.2,19.3 54.6,19.3 56.6,17.3 56.4,17.1 56,17.1 54.3,18.8 51.8,18.8 49.7,20.9 49.7,55.6 28.9,76.4 24.2,76.4 24,76.6 24,77
VDDLS
  Top 0.406: POWER.6 36.43,79.27 56.6,59.1 56.6,21 C37.1 C38.1 62.5,17.6 62.5,14.66 JP1.13
  pour Top: 24.1,79.6 36.6,79.6 57.1,59.1 57.1,20.9 58.6,19.4 61.1,19.4 62.7,17.8 62.7,16.8 60.8,18.7 58.5,18.7 56.2,21 56.2,58.6 36,78.8 24.2,78.8 24,79 24,79.5
WAKEUP_SIGNAL
  Top 0.2: WAKEUP.2 24.7,57.3 26,56 26,53 24.3,51.3 23.2,51.3 22.37,50.47 IC6.2
WS_OPAMP  (via drill 0.35)
  Top 0.2: R6.2 20.31,48.79 IC6.1 20.1,47.79 R4.2 19.9,43.3 11.2,43.3 10.2,42.3 10.2,40.8 11.8,39.2 VR2.2
  Top 0.305: IC5.2 9.8,21.5 v9.4,21.9
  Bottom 0.305: v9.4,21.9 11.8,24.3 v11.8,26.63 VR2.2

### Text on the board
tPlace: TX | RX | VDD | OPEN8 | VDDLS | CS | VDDH | COPI | VCCQ | CIPO | 2.5V | 3.3V | SCK | DIN | VDD | GND | DIN | CLK | CS | DC | RST | BUSY | 0 | 1
tNames: Open8 Epaper Demo Board - SOTB V1.0 / Copyright © UEC PHAM LAB 2022 | GND | 3.3V IN | LDO | 0.5V | 1.2V | 1.2V IN | 1.2V | 0.9V | LDO | GND | top | AND_RST | SW_RST